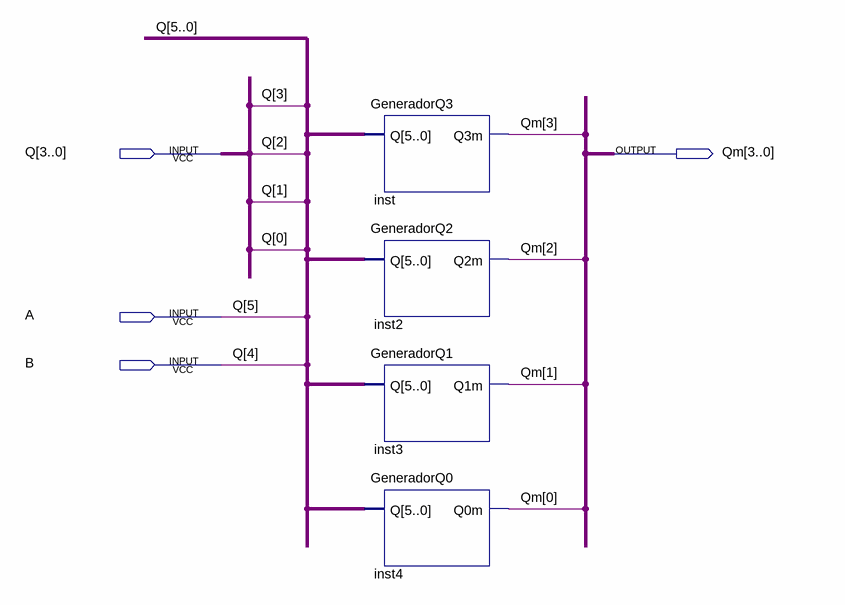
[diagram p0: schematic sheet]
// Quartus schematic GeneradorEstado.bdf as structural Verilog: 4 symbols, 4 pins
module GeneradorEstado (
  input  [3:0] Q,
  input  A,
  input  B,
  output [3:0] Qm
);

  GeneradorQ3 inst (.Q({A, B, Q}), .Q3m(Qm[3]));
  GeneradorQ2 inst2 (.Q({A, B, Q}), .Q2m(Qm[2]));
  GeneradorQ1 inst3 (.Q({A, B, Q}), .Q1m(Qm[1]));
  GeneradorQ0 inst4 (.Q({A, B, Q}), .Q0m(Qm[0]));

  // Other names for the same wires on the sheet: Q[5:4] = {A, B}
endmodule
